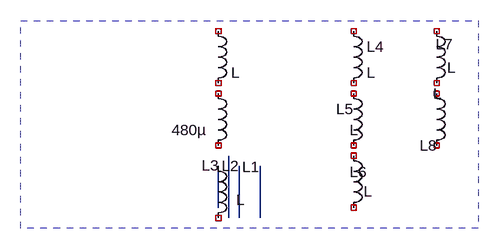
[diagram p0: schematic ind.asc]
ind.asc, the LTspice schematic file:
Version 4
SHEET 1 880 680
WIRE 160 320 160 256
WIRE 176 336 176 240
WIRE 192 336 192 256
WIRE 224 336 224 256
SYMBOL ind 144 32 R0
WINDOW 0 80 225 Right 2
SYMATTR InstName L1
SYMBOL ind 144 128 R0
WINDOW 3 -29 72 Center 2
WINDOW 0 48 128 Right 2
SYMATTR Value 480µ
SYMATTR InstName L2
SYMBOL ind 144 240 R0
WINDOW 3 50 68 Center 2
WINDOW 0 17 15 Right 2
SYMATTR InstName L3
SYMBOL ind 352 32 R0
SYMATTR InstName L4
SYMBOL ind 352 128 R0
WINDOW 3 17 72 Center 2
WINDOW 0 16 40 Right 2
SYMATTR InstName L5
SYMBOL ind 352 224 R0
WINDOW 3 38 71 Center 2
WINDOW 0 37 41 Right 2
SYMATTR InstName L6
SYMBOL ind 480 32 R0
WINDOW 3 39 72 Center 2
WINDOW 0 41 36 Right 2
SYMATTR InstName L7
SYMBOL ind 480 128 R0
WINDOW 3 17 16 Center 2
WINDOW 0 17 96 Right 2
SYMATTR InstName L8
RECTANGLE Normal 560 352 -144 32 2

The netlist it stands for:
* ind.asc
L1 NC_01 NC_02 L
L2 NC_03 NC_04 480µ
L3 N001 NC_05 L
L4 NC_06 NC_07 L
L5 NC_08 NC_09 L
L6 NC_10 NC_11 L
L7 NC_12 NC_13 L
L8 NC_14 NC_15 L
.backanno
.end